# Altium schematic sheet Main.SchDoc
size 165 x 147 mm
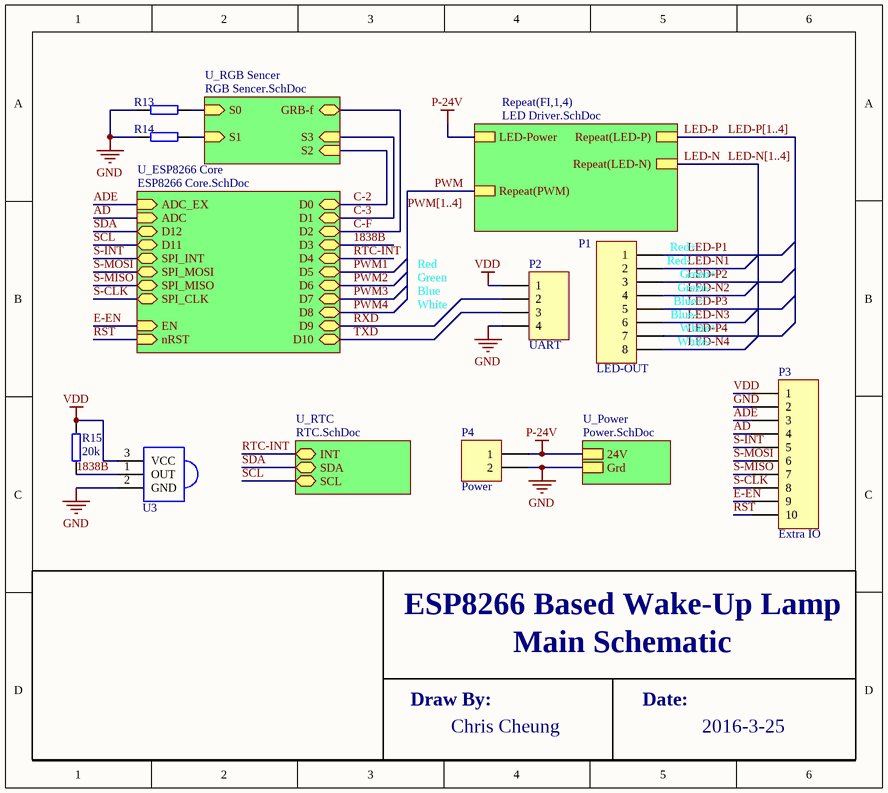
[diagram p0: Main.SchDoc]

## Parts
P1  LED-OUT  [HDR1X8H]
P2  UART  [HDR1X4H]
P3  Extra IO  [HDR1X10H]
P4  Power  [HDR1X2]
R13  0Ohm  [SMT_R_0402]  (value not drawn)
R14  0Ohm  [SMT_R_0402]  (value not drawn)
R15  20k  [SMT_R_0402]
U3  Infrared In-VS1838  (value not drawn)

## Sub-sheets
Repeat(FI,1,4) = LED Driver.SchDoc: Repeat(LED-P), Repeat(LED-N), Repeat(PWM), LED-Power
U_ESP8266 Core = ESP8266 Core.SchDoc: D0 (bidir), D1 (bidir), D2 (bidir), D3 (bidir), D4 (bidir), D5 (bidir), D6 (bidir), D7 (bidir), D8 (bidir), D9 (bidir), D10 (bidir), D11 (bidir), D12 (bidir), SPI_INT (bidir), SPI_MOSI (bidir), SPI_MISO (bidir), SPI_CLK (bidir), nRST (in), ADC_EX (in), ADC (in), EN (in)
U_Power = Power.SchDoc: 24V, Grd
U_RGB Sencer = RGB Sencer.SchDoc: S0 (in), S1 (in), S2 (in), S3 (in), GRB-f (bidir)
U_RTC = RTC.SchDoc: INT (bidir), SDA (bidir), SCL (bidir)

## Nets
GND: P2.4 P3.2 P4.2 R13.1 R14.1 U3.2(GND) ; sheet U_Power/Grd
P-24V: P4.1 ; sheet U_Power/24V, sheet Repeat(FI,1,4)/LED-Power
VDD: P2.1 P3.1 R15.2 U3.3(VCC)
1838B: R15.1 U3.1(OUT) ; sheet U_ESP8266 Core/D3
AD: P3.4 ; sheet U_ESP8266 Core/ADC
ADE: P3.3 ; sheet U_ESP8266 Core/ADC_EX
C-2: sheet U_ESP8266 Core/D0, sheet U_RGB Sencer/S2
C-3: sheet U_ESP8266 Core/D1, sheet U_RGB Sencer/S3
C-F: sheet U_ESP8266 Core/D2, sheet U_RGB Sencer/GRB-f
E-EN: P3.9 ; sheet U_ESP8266 Core/EN
LED-N: sheet Repeat(FI,1,4)/Repeat(LED-N)
LED-N1: P1.2
LED-N2: P1.4
LED-N3: P1.6
LED-N4: P1.8
LED-P: sheet Repeat(FI,1,4)/Repeat(LED-P)
LED-P1: P1.1
LED-P2: P1.3
LED-P3: P1.5
LED-P4: P1.7
PWM: sheet Repeat(FI,1,4)/Repeat(PWM)
PWM1: sheet U_ESP8266 Core/D5
PWM2: sheet U_ESP8266 Core/D6
PWM3: sheet U_ESP8266 Core/D7
PWM4: sheet U_ESP8266 Core/D8
RST: P3.10 ; sheet U_ESP8266 Core/nRST
RTC-INT: sheet U_ESP8266 Core/D4, sheet U_RTC/INT
RXD: P2.2 ; sheet U_ESP8266 Core/D9
S-CLK: P3.8 ; sheet U_ESP8266 Core/SPI_CLK
S-INT: P3.5 ; sheet U_ESP8266 Core/SPI_INT
S-MISO: P3.7 ; sheet U_ESP8266 Core/SPI_MISO
S-MOSI: P3.6 ; sheet U_ESP8266 Core/SPI_MOSI
SCL: sheet U_ESP8266 Core/D11, sheet U_RTC/SCL
SDA: sheet U_ESP8266 Core/D12, sheet U_RTC/SDA
TXD: P2.3 ; sheet U_ESP8266 Core/D10
NetR13_2: R13.2 ; sheet U_RGB Sencer/S0
NetR14_2: R14.2 ; sheet U_RGB Sencer/S1

## Buses and harness runs
bus LED-N[1..4]
bus LED-P[1..4]
bus PWM[1..4]

## Notes on the sheet
- Red
- (near P1) Red-
- (near P1) Red+
- (near P1) Green+
- Green
- Blue
- White
- (near P1) Blue-
- (near P1) Blue+
- (near P1) Green-
- (near P1) White+
- (near P1) White-
- ESP8266 Based Wake-Up Lamp
- Main Schematic
- Draw By:
- Chris Cheung
- Date:
- 2016-3-25

## Library data of the parts
P1 = Header 8H: Header, 8-Pin, Right Angle; LatestRevisionDate: 17-Jul-2002; LatestRevisionNote: Re-released for DXP Platform.; Publisher: Altium Limited
P2 = Header 4H: Header, 4-Pin, Right Angle; LatestRevisionDate: 17-Jul-2002; LatestRevisionNote: Re-released for DXP Platform.; Publisher: Altium Limited
P3 = Header 10H: Header, 10-Pin, Right Angle; LatestRevisionDate: 17-Jul-2002; LatestRevisionNote: Re-released for DXP Platform.; Publisher: Altium Limited
P4 = Header 2: Header, 2-Pin; LatestRevisionDate: 17-Jul-2002; LatestRevisionNote: Re-released for DXP Platform.; Publisher: Altium Limited
R13-R15 = SMT_R_0402: Surface mount resistor 0402
U3 = VS1838: Infrared In